# EAGLE schematic Line sensors - 6 (EAGLE 9.5.2)
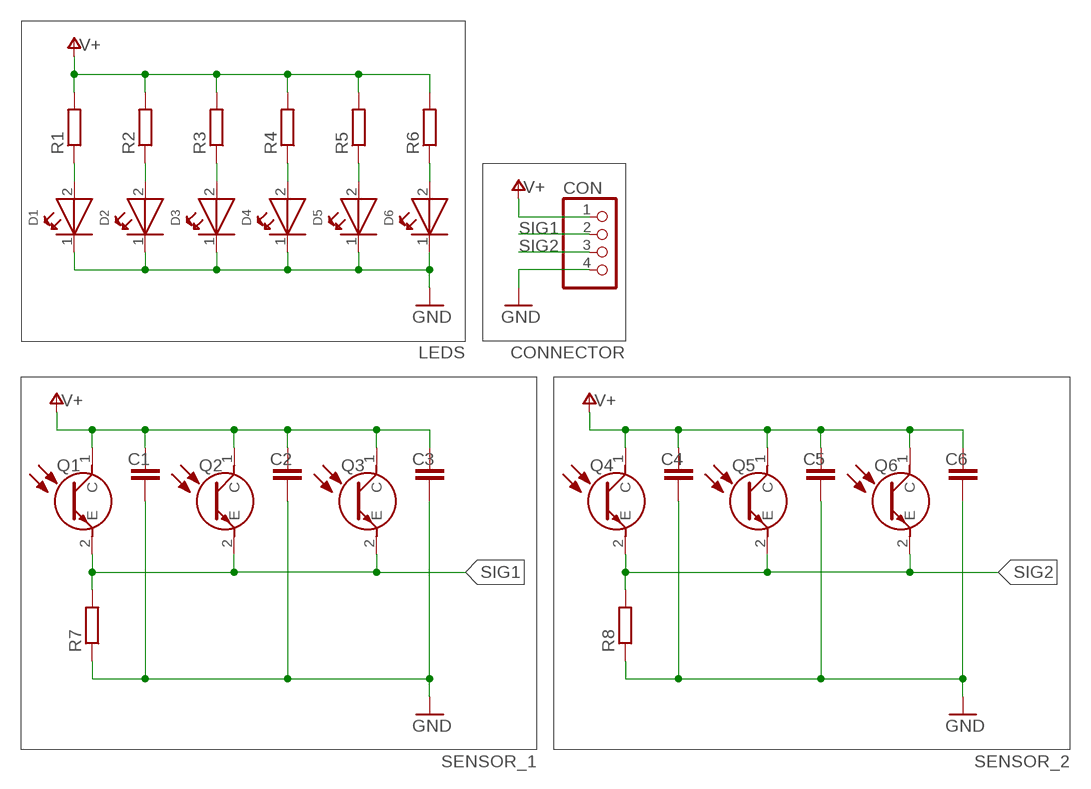
[diagram p0: schematic, sheet 1]

## Parts
C1  C-EUC0805  [C0805]
C2  C-EUC0805  [C0805]
C3  C-EUC0805  [C0805]
C4  C-EUC0805  [C0805]
C5  C-EUC0805  [C0805]
C6  C-EUC0805  [C0805]
CON  PINHD-1X4  [1X04]
D1  WL-SMTW-150141AS73100-A  [3528-2PIN]
D2  WL-SMTW-150141AS73100-A  [3528-2PIN]
D3  WL-SMTW-150141AS73100-A  [3528-2PIN]
D4  WL-SMTW-150141AS73100-A  [3528-2PIN]
D5  WL-SMTW-150141AS73100-A  [3528-2PIN]
D6  WL-SMTW-150141AS73100-A  [3528-2PIN]
Q1  VEMT2520X01  [VEMT2520X01]
Q2  VEMT2520X01  [VEMT2520X01]
Q3  VEMT2520X01  [VEMT2520X01]
Q4  VEMT2520X01  [VEMT2520X01]
Q5  VEMT2520X01  [VEMT2520X01]
Q6  VEMT2520X01  [VEMT2520X01]
R1  R-EU_R0805  [R0805]
R2  R-EU_R0805  [R0805]
R3  R-EU_R0805  [R0805]
R4  R-EU_R0805  [R0805]
R5  R-EU_R0805  [R0805]
R6  R-EU_R0805  [R0805]
R7  R-EU_R0805  [R0805]
R8  R-EU_R0805  [R0805]

## Nets
GND: C1.2 C2.2 C3.2 C4.2 C5.2 C6.2 CON.4 D1.1(K) D2.1(K) D3.1(K) D4.1(K) D5.1(K) D6.1(K) R7.1 R8.1
N$1: D1.2(A) R1.1
N$2: D2.2(A) R2.1
N$3: D3.2(A) R3.1
N$4: D4.2(A) R4.1
N$5: D5.2(A) R5.1
N$6: D6.2(A) R6.1
SIG1: CON.2 Q1.2(E) Q2.2(E) Q3.2(E) R7.2
SIG2: CON.3 Q4.2(E) Q5.2(E) Q6.2(E) R8.2
V+: C1.1 C2.1 C3.1 C4.1 C5.1 C6.1 CON.1 Q1.1(C) Q2.1(C) Q3.1(C) Q4.1(C) Q5.1(C) Q6.1(C) R1.2 R2.2 R3.2 R4.2 R5.2 R6.2

## Notes on the sheet
- LEDS | CONNECTOR
- SENSOR_1 | SENSOR_2

## Library data of the parts
C1-C6 = rcl:C-EU: CAPACITOR, European symbol; SPICEPREFIX: C
CON = pinhead:PINHD-1X4: PIN HEADER
D1-D6 = Wurth_Elektronik_Optoelectronics_rev15b:WL-SMTW: SMD Side view mono-color round Characteristics Low power consumption High reliability Low current requirement No UV/IR radiation Wide viewing angle Excelllent for edge lighting displays and backlighting indicators Ideal for miniature applications PBC high-usage Compatible with automatic placement equipment Applications Backlighting for LCD Sidelighting applications Indicator and backlighting for telecommunication Backlighting for symbol, switch and dashboard General use <http://katalog.we-online.de/media/images/eipal/WL-SMTW_pf2.jpg> Details see: http://katalog.we-online.de/en/led/WL-SMTW?m Updated: 2015-04-10 2015 (C) Wurth Elektronik; COMPANY-URL: http://www.we-online.de; CREATED-BY: Christin Otto; CREATED-DATE: APR 2013; DATASHEET-URL: http://katalog.we-online.de/en/led/WL-SMTW?m=t&sq=smtw&sp=&sp=http%3A%2F%2Fwww.we-online.de%2Fweb%2Fen%2Felectronic_components%2Fsearchpage_PBS.php%3Fsearch%3Dsmtw; MANUFACTURER: Würth Elektronik eiSos GmbH
Q1-Q6 = Fototransistor:VEMT2520X01: Vishay VEMT2520X01 +/-15 IR + Visible Light Phototransistor, Surface Mount 2-Pin Reverse Gullwing Package Source: Datasheet <https://www.vishay.com/docs/81134/vemt2500.pdf>; DESCRIPTION: Vishay VEMT2520X01 +/-15 IR + Visible Light Phototransistor, Surface Mount 2-Pin Reverse Gullwing Package; HEIGHT: 2mm; MANUFACTURER_NAME: Vishay; MANUFACTURER_PART_NUMBER: VEMT2520X01; MOUSER_PART_NUMBER: 782-VEMT2520X01; MOUSER_PRICE-STOCK: https://www.mouser.com/Search/Refine.aspx?Keyword=782-VEMT2520X01; RS_PART_NUMBER: 7689417P; RS_PRICE-STOCK: http://uk.rs-online.com/web/p/products/7689417P
R1-R8 = rcl:R-EU_: RESISTOR, European symbol; SPICEPREFIX: R